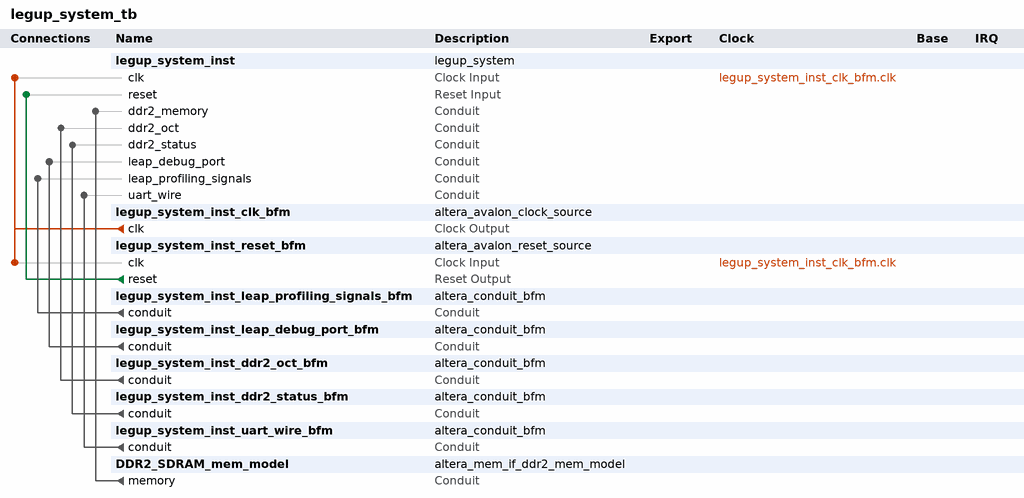
[diagram p0: system contents]
# Platform Designer (Qsys) system legup_system_tb, Stratix IV EP4SGX530KH40C2
# Parameters at their usual value, and those the tool derives, are not listed.
package require -exact qsys 13.1
create_system legup_system_tb
set_project_property DEVICE_FAMILY {Stratix IV}
set_project_property DEVICE EP4SGX530KH40C2

add_instance legup_system_inst legup_system 1.0

add_instance legup_system_inst_clk_bfm altera_avalon_clock_source 13.1

add_instance legup_system_inst_reset_bfm altera_avalon_reset_source 13.1
set_instance_parameter_value legup_system_inst_reset_bfm ASSERT_HIGH_RESET 0
set_instance_parameter_value legup_system_inst_reset_bfm INITIAL_RESET_CYCLES 50

add_instance legup_system_inst_leap_profiling_signals_bfm altera_conduit_bfm 13.1
set_instance_parameter_value legup_system_inst_leap_profiling_signals_bfm CLOCKED_SIGNAL false
set_instance_parameter_value legup_system_inst_leap_profiling_signals_bfm ENABLE_RESET false
set_instance_parameter_value legup_system_inst_leap_profiling_signals_bfm SIGNAL_ROLES start,end
set_instance_parameter_value legup_system_inst_leap_profiling_signals_bfm SIGNAL_WIDTHS 1,1
set_instance_parameter_value legup_system_inst_leap_profiling_signals_bfm SIGNAL_DIRECTIONS input,input

add_instance legup_system_inst_leap_debug_port_bfm altera_conduit_bfm 13.1
set_instance_parameter_value legup_system_inst_leap_debug_port_bfm CLOCKED_SIGNAL false
set_instance_parameter_value legup_system_inst_leap_debug_port_bfm ENABLE_RESET false
set_instance_parameter_value legup_system_inst_leap_debug_port_bfm SIGNAL_ROLES select,lights
set_instance_parameter_value legup_system_inst_leap_debug_port_bfm SIGNAL_WIDTHS 3,18
set_instance_parameter_value legup_system_inst_leap_debug_port_bfm SIGNAL_DIRECTIONS output,input

add_instance legup_system_inst_ddr2_oct_bfm altera_conduit_bfm 13.1
set_instance_parameter_value legup_system_inst_ddr2_oct_bfm CLOCKED_SIGNAL false
set_instance_parameter_value legup_system_inst_ddr2_oct_bfm ENABLE_RESET false
set_instance_parameter_value legup_system_inst_ddr2_oct_bfm SIGNAL_ROLES rdn,rup
set_instance_parameter_value legup_system_inst_ddr2_oct_bfm SIGNAL_WIDTHS 1,1
set_instance_parameter_value legup_system_inst_ddr2_oct_bfm SIGNAL_DIRECTIONS output,output

add_instance legup_system_inst_ddr2_status_bfm altera_conduit_bfm 13.1
set_instance_parameter_value legup_system_inst_ddr2_status_bfm CLOCKED_SIGNAL false
set_instance_parameter_value legup_system_inst_ddr2_status_bfm ENABLE_RESET false
set_instance_parameter_value legup_system_inst_ddr2_status_bfm SIGNAL_ROLES local_init_done,local_cal_success,local_cal_fail
set_instance_parameter_value legup_system_inst_ddr2_status_bfm SIGNAL_WIDTHS 1,1,1
set_instance_parameter_value legup_system_inst_ddr2_status_bfm SIGNAL_DIRECTIONS input,input,input

add_instance legup_system_inst_uart_wire_bfm altera_conduit_bfm 13.1
set_instance_parameter_value legup_system_inst_uart_wire_bfm CLOCKED_SIGNAL false
set_instance_parameter_value legup_system_inst_uart_wire_bfm ENABLE_RESET false
set_instance_parameter_value legup_system_inst_uart_wire_bfm SIGNAL_ROLES rxd,txd
set_instance_parameter_value legup_system_inst_uart_wire_bfm SIGNAL_WIDTHS 1,1
set_instance_parameter_value legup_system_inst_uart_wire_bfm SIGNAL_DIRECTIONS output,input

add_instance DDR2_SDRAM_mem_model altera_mem_if_ddr2_mem_model 13.1
set_instance_parameter_value DDR2_SDRAM_mem_model MEM_VENDOR Micron
set_instance_parameter_value DDR2_SDRAM_mem_model MEM_FORMAT UNBUFFERED
set_instance_parameter_value DDR2_SDRAM_mem_model DISCRETE_FLY_BY true
set_instance_parameter_value DDR2_SDRAM_mem_model DEVICE_DEPTH 1
set_instance_parameter_value DDR2_SDRAM_mem_model MEM_MIRROR_ADDRESSING 0
set_instance_parameter_value DDR2_SDRAM_mem_model MEM_CLK_FREQ_MAX 400.0
set_instance_parameter_value DDR2_SDRAM_mem_model MEM_ROW_ADDR_WIDTH 14
set_instance_parameter_value DDR2_SDRAM_mem_model MEM_COL_ADDR_WIDTH 10
set_instance_parameter_value DDR2_SDRAM_mem_model MEM_DQ_WIDTH 64
set_instance_parameter_value DDR2_SDRAM_mem_model MEM_DQ_PER_DQS 8
set_instance_parameter_value DDR2_SDRAM_mem_model MEM_BANKADDR_WIDTH 3
set_instance_parameter_value DDR2_SDRAM_mem_model MEM_IF_DM_PINS_EN true
set_instance_parameter_value DDR2_SDRAM_mem_model MEM_IF_DQSN_EN true
set_instance_parameter_value DDR2_SDRAM_mem_model MEM_NUMBER_OF_DIMMS 1
set_instance_parameter_value DDR2_SDRAM_mem_model MEM_NUMBER_OF_RANKS_PER_DIMM 1
set_instance_parameter_value DDR2_SDRAM_mem_model MEM_NUMBER_OF_RANKS_PER_DEVICE 1
set_instance_parameter_value DDR2_SDRAM_mem_model MEM_RANK_MULTIPLICATION_FACTOR 1
set_instance_parameter_value DDR2_SDRAM_mem_model MEM_CK_WIDTH 2
set_instance_parameter_value DDR2_SDRAM_mem_model MEM_CS_WIDTH 1
set_instance_parameter_value DDR2_SDRAM_mem_model MEM_CLK_EN_WIDTH 1
set_instance_parameter_value DDR2_SDRAM_mem_model ALTMEMPHY_COMPATIBLE_MODE false
set_instance_parameter_value DDR2_SDRAM_mem_model NEXTGEN true
set_instance_parameter_value DDR2_SDRAM_mem_model MEM_IF_BOARD_BASE_DELAY 10
set_instance_parameter_value DDR2_SDRAM_mem_model MEM_IF_SIM_VALID_WINDOW 0
set_instance_parameter_value DDR2_SDRAM_mem_model MEM_GUARANTEED_WRITE_INIT false
set_instance_parameter_value DDR2_SDRAM_mem_model MEM_VERBOSE true
set_instance_parameter_value DDR2_SDRAM_mem_model PINGPONGPHY_EN false
set_instance_parameter_value DDR2_SDRAM_mem_model REFRESH_BURST_VALIDATION false
set_instance_parameter_value DDR2_SDRAM_mem_model MEM_BL 8
set_instance_parameter_value DDR2_SDRAM_mem_model MEM_BT Sequential
set_instance_parameter_value DDR2_SDRAM_mem_model MEM_ASR Manual
set_instance_parameter_value DDR2_SDRAM_mem_model MEM_SRT {2x refresh rate}
set_instance_parameter_value DDR2_SDRAM_mem_model MEM_PD {Fast exit}
set_instance_parameter_value DDR2_SDRAM_mem_model MEM_DRV_STR Full
set_instance_parameter_value DDR2_SDRAM_mem_model MEM_DLL_EN true
set_instance_parameter_value DDR2_SDRAM_mem_model MEM_RTT_NOM 50
set_instance_parameter_value DDR2_SDRAM_mem_model MEM_ATCL 0
set_instance_parameter_value DDR2_SDRAM_mem_model MEM_TCL 6
set_instance_parameter_value DDR2_SDRAM_mem_model MEM_AUTO_LEVELING_MODE true
set_instance_parameter_value DDR2_SDRAM_mem_model MEM_USER_LEVELING_MODE Leveling
set_instance_parameter_value DDR2_SDRAM_mem_model MEM_INIT_EN false
set_instance_parameter_value DDR2_SDRAM_mem_model DAT_DATA_WIDTH 32
set_instance_parameter_value DDR2_SDRAM_mem_model TIMING_TIS 375
set_instance_parameter_value DDR2_SDRAM_mem_model TIMING_TIH 375
set_instance_parameter_value DDR2_SDRAM_mem_model TIMING_TDS 250
set_instance_parameter_value DDR2_SDRAM_mem_model TIMING_TDH 250
set_instance_parameter_value DDR2_SDRAM_mem_model TIMING_TDQSQ 200
set_instance_parameter_value DDR2_SDRAM_mem_model TIMING_TQHS 300
set_instance_parameter_value DDR2_SDRAM_mem_model TIMING_TDQSCK 350
set_instance_parameter_value DDR2_SDRAM_mem_model TIMING_TDQSCKDS 450
set_instance_parameter_value DDR2_SDRAM_mem_model TIMING_TDQSCKDM 900
set_instance_parameter_value DDR2_SDRAM_mem_model TIMING_TDQSCKDL 1200
set_instance_parameter_value DDR2_SDRAM_mem_model TIMING_TDQSS 0.25
set_instance_parameter_value DDR2_SDRAM_mem_model TIMING_TDQSH 0.35
set_instance_parameter_value DDR2_SDRAM_mem_model TIMING_TDSH 0.2
set_instance_parameter_value DDR2_SDRAM_mem_model TIMING_TDSS 0.2
set_instance_parameter_value DDR2_SDRAM_mem_model MEM_TINIT_US 200
set_instance_parameter_value DDR2_SDRAM_mem_model MEM_TMRD_CK 5
set_instance_parameter_value DDR2_SDRAM_mem_model MEM_TRAS_NS 40.0
set_instance_parameter_value DDR2_SDRAM_mem_model MEM_TRCD_NS 15.0
set_instance_parameter_value DDR2_SDRAM_mem_model MEM_TRP_NS 15.0
set_instance_parameter_value DDR2_SDRAM_mem_model MEM_TREFI_US 7.8
set_instance_parameter_value DDR2_SDRAM_mem_model MEM_TRFC_NS 127.5
set_instance_parameter_value DDR2_SDRAM_mem_model CFG_TCCD_NS 2.5
set_instance_parameter_value DDR2_SDRAM_mem_model MEM_TWR_NS 15.0
set_instance_parameter_value DDR2_SDRAM_mem_model MEM_TWTR 3
set_instance_parameter_value DDR2_SDRAM_mem_model MEM_TFAW_NS 37.5
set_instance_parameter_value DDR2_SDRAM_mem_model MEM_TRRD_NS 7.5
set_instance_parameter_value DDR2_SDRAM_mem_model MEM_TRTP_NS 7.5
set_instance_parameter_value DDR2_SDRAM_mem_model RATE Half
set_instance_parameter_value DDR2_SDRAM_mem_model MEM_CLK_FREQ 400.0
set_instance_parameter_value DDR2_SDRAM_mem_model USE_MEM_CLK_FREQ false
set_instance_parameter_value DDR2_SDRAM_mem_model FORCE_DQS_TRACKING AUTO
set_instance_parameter_value DDR2_SDRAM_mem_model FORCE_SHADOW_REGS AUTO
set_instance_parameter_value DDR2_SDRAM_mem_model MRS_MIRROR_PING_PONG_ATSO false
set_instance_parameter_value DDR2_SDRAM_mem_model PARSE_FRIENDLY_DEVICE_FAMILY_PARAM_VALID false
set_instance_parameter_value DDR2_SDRAM_mem_model SPEED_GRADE 2
set_instance_parameter_value DDR2_SDRAM_mem_model IS_ES_DEVICE false
set_instance_parameter_value DDR2_SDRAM_mem_model DISABLE_CHILD_MESSAGING false
set_instance_parameter_value DDR2_SDRAM_mem_model HARD_EMIF false
set_instance_parameter_value DDR2_SDRAM_mem_model HHP_HPS false
set_instance_parameter_value DDR2_SDRAM_mem_model HHP_HPS_VERIFICATION false
set_instance_parameter_value DDR2_SDRAM_mem_model HHP_HPS_SIMULATION false
set_instance_parameter_value DDR2_SDRAM_mem_model HPS_PROTOCOL DEFAULT
set_instance_parameter_value DDR2_SDRAM_mem_model CUT_NEW_FAMILY_TIMING true

# connections
add_connection legup_system_inst_clk_bfm.clk legup_system_inst.clk clock
add_connection legup_system_inst_clk_bfm.clk legup_system_inst_reset_bfm.clk clock
add_connection legup_system_inst_reset_bfm.reset legup_system_inst.reset reset
add_connection DDR2_SDRAM_mem_model.memory legup_system_inst.ddr2_memory conduit
add_connection legup_system_inst_ddr2_oct_bfm.conduit legup_system_inst.ddr2_oct conduit
add_connection legup_system_inst_ddr2_status_bfm.conduit legup_system_inst.ddr2_status conduit
add_connection legup_system_inst_leap_debug_port_bfm.conduit legup_system_inst.leap_debug_port conduit
add_connection legup_system_inst_leap_profiling_signals_bfm.conduit legup_system_inst.leap_profiling_signals conduit
add_connection legup_system_inst_uart_wire_bfm.conduit legup_system_inst.uart_wire conduit

set_interconnect_requirement {$system} qsys_mm.clockCrossingAdapter HANDSHAKE
set_interconnect_requirement {$system} qsys_mm.maxAdditionalLatency 1
set_interconnect_requirement {$system} qsys_mm.insertDefaultSlave false

save_system legup_system_tb.qsys
